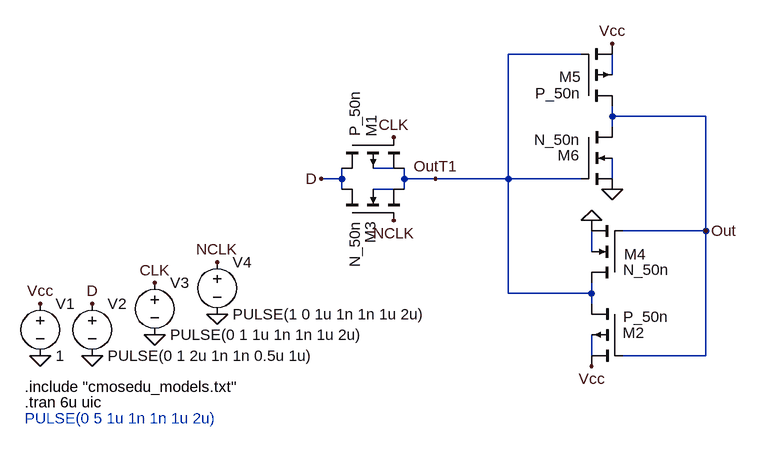
[diagram p0: schematic 1_ValidacionT1yT2.asc]
1_ValidacionT1yT2.asc, the LTspice schematic file:
Version 4
SHEET 1 1840 680
WIRE 1344 -32 1232 -32
WIRE 1392 0 1392 -32
WIRE 1392 64 1392 48
WIRE 1536 64 1392 64
WIRE 1392 80 1392 64
WIRE 1056 144 1024 144
WIRE 976 160 976 144
WIRE 976 160 944 160
WIRE 1072 160 1072 144
WIRE 1120 160 1072 160
WIRE 1232 160 1232 -32
WIRE 1232 160 1120 160
WIRE 1344 160 1232 160
WIRE 1392 160 1392 128
WIRE 976 176 976 160
WIRE 1056 176 1024 176
WIRE 1072 176 1072 160
WIRE 1536 240 1536 64
WIRE 1536 240 1408 240
WIRE 1360 272 1360 240
WIRE 1232 336 1232 160
WIRE 1360 336 1360 320
WIRE 1360 336 1232 336
WIRE 1360 352 1360 336
WIRE 1360 432 1360 400
WIRE 1536 432 1536 240
WIRE 1536 432 1408 432
FLAG 592 432 0
FLAG 592 352 D
FLAG 944 160 D
FLAG 688 400 0
FLAG 688 320 CLK
FLAG 784 368 0
FLAG 784 288 NCLK
FLAG 1120 160 OutT1
FLAG 1056 96 CLK
FLAG 1056 224 NCLK
FLAG 512 432 0
FLAG 512 352 Vcc
FLAG 1392 176 0
FLAG 1392 -48 Vcc
FLAG 1360 224 0
FLAG 1360 448 Vcc
FLAG 1536 240 Out
SYMBOL pmos4 976 96 M90
WINDOW 0 0 45 Right 2
WINDOW 3 -1 20 Right 2
SYMATTR InstName M1
SYMATTR Value P_50n
SYMATTR Value2 l=50n w=1200n
SYMBOL nmos4 976 224 R270
WINDOW 0 -2 44 Right 2
WINDOW 3 -1 20 Right 2
SYMATTR InstName M3
SYMATTR Value N_50n
SYMATTR Value2 l=50n w=800n
SYMBOL voltage 592 336 R0
WINDOW 123 0 0 Left 0
WINDOW 39 0 0 Left 0
SYMATTR InstName V2
SYMATTR Value PULSE(0 1 2u 1n 1n 0.5u 1u)
SYMBOL voltage 688 304 R0
WINDOW 123 0 0 Left 0
WINDOW 39 0 0 Left 0
SYMATTR InstName V3
SYMATTR Value PULSE(0 1 1u 1n 1n 1u 2u)
SYMBOL voltage 784 272 R0
WINDOW 123 0 0 Left 0
WINDOW 39 0 0 Left 0
SYMATTR InstName V4
SYMATTR Value PULSE(1 0 1u 1n 1n 1u 2u)
SYMBOL voltage 512 336 R0
WINDOW 123 0 0 Left 0
WINDOW 39 0 0 Left 0
SYMATTR InstName V1
SYMATTR Value 1
SYMBOL pmos4 1344 48 M180
WINDOW 0 0 45 Right 2
WINDOW 3 -1 20 Right 2
SYMATTR InstName M5
SYMATTR Value P_50n
SYMATTR Value2 l=50n w=1200n
SYMBOL nmos4 1344 80 R0
WINDOW 0 -2 44 Right 2
WINDOW 3 -1 20 Right 2
SYMATTR InstName M6
SYMATTR Value N_50n
SYMATTR Value2 l=50n w=800n
SYMBOL pmos4 1408 352 M0
WINDOW 0 0 45 Right 2
WINDOW 3 -1 20 Right 2
SYMATTR InstName M2
SYMATTR Value P_50n
SYMATTR Value2 l=50n w=300n
SYMBOL nmos4 1408 320 R180
WINDOW 0 -2 44 Right 2
WINDOW 3 -1 20 Right 2
SYMATTR InstName M4
SYMATTR Value N_50n
SYMATTR Value2 l=50n w=200n
TEXT 488 480 Left 2 !.include "cmosedu_models.txt"
TEXT 488 528 Left 2 ;PULSE(0 5 1u 1n 1n 1u 2u)
TEXT 488 504 Left 2 !.tran 6u uic

The netlist it stands for:
* 1_ValidacionT1yT2.asc
M1 D CLK OutT1 N002 P_50n l=50n w=1200n
M3 D NCLK OutT1 N004 N_50n l=50n w=800n
V2 D 0 PULSE(0 1 2u 1n 1n 0.5u 1u)
V3 CLK 0 PULSE(0 1 1u 1n 1n 1u 2u)
V4 NCLK 0 PULSE(1 0 1u 1n 1n 1u 2u)
V1 Vcc 0 1
M5 Out OutT1 Vcc N001 P_50n l=50n w=1200n
M6 Out OutT1 0 N003 N_50n l=50n w=800n
M2 OutT1 Out Vcc N006 P_50n l=50n w=300n
M4 OutT1 Out 0 N005 N_50n l=50n w=200n
.model NMOS NMOS
.model PMOS PMOS
.lib standard.mos
.include "cmosedu_models.txt"
* PULSE(0 5 1u 1n 1n 1u 2u)
.tran 6u uic
.backanno
.end